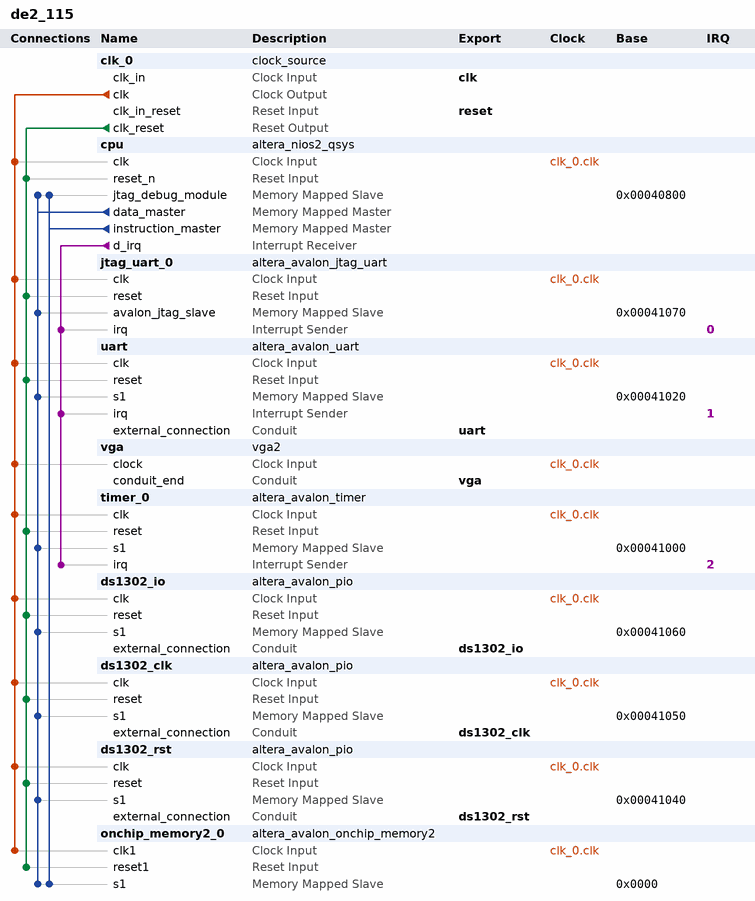
[diagram p0: system contents]
# Platform Designer (Qsys) system de2_115, Cyclone IV E EP4CE115F29C7
# Parameters at their usual value, and those the tool derives, are not listed.
package require -exact qsys 13.0.1.99.2
create_system de2_115
set_project_property DEVICE_FAMILY {Cyclone IV E}
set_project_property DEVICE EP4CE115F29C7

add_instance clk_0 clock_source 13.0
set_instance_parameter_value clk_0 clockFrequency 50000000

add_instance cpu altera_nios2_qsys 13.0
set_instance_parameter_value cpu resetSlave onchip_memory2_0.s1
set_instance_parameter_value cpu mmu_TLBMissExcSlave None
set_instance_parameter_value cpu exceptionSlave onchip_memory2_0.s1
set_instance_parameter_value cpu breakSlave cpu.jtag_debug_module
set_instance_parameter_value cpu muldiv_multiplierType NoneSmall
set_instance_parameter_value cpu impl Tiny
set_instance_parameter_value cpu icache_size 4096

add_instance jtag_uart_0 altera_avalon_jtag_uart 13.0.1.99.2
set_instance_parameter_value jtag_uart_0 simInteractiveOptions NO_INTERACTIVE_WINDOWS

add_instance uart altera_avalon_uart 13.0.1.99.2
set_instance_parameter_value uart baud 115200
set_instance_parameter_value uart dataBits 8
set_instance_parameter_value uart fixedBaud true
set_instance_parameter_value uart parity NONE
set_instance_parameter_value uart stopBits 1

add_instance vga vga2 1.0
set_instance_parameter_value vga CLOCK_OUTPUT 1
set_instance_parameter_value vga BITS_PER_COLOR 1

add_instance timer_0 altera_avalon_timer 13.0.1.99.2
set_instance_parameter_value timer_0 period 1
set_instance_parameter_value timer_0 periodUnits SEC

add_instance ds1302_io altera_avalon_pio 13.0.1.99.2
set_instance_parameter_value ds1302_io direction Bidir
set_instance_parameter_value ds1302_io width 1

add_instance ds1302_clk altera_avalon_pio 13.0.1.99.2
set_instance_parameter_value ds1302_clk direction Output
set_instance_parameter_value ds1302_clk width 1

add_instance ds1302_rst altera_avalon_pio 13.0.1.99.2
set_instance_parameter_value ds1302_rst direction Output
set_instance_parameter_value ds1302_rst width 1

add_instance onchip_memory2_0 altera_avalon_onchip_memory2 13.0.1.99.2
set_instance_parameter_value onchip_memory2_0 dataWidth 32
set_instance_parameter_value onchip_memory2_0 dualPort false
set_instance_parameter_value onchip_memory2_0 initMemContent true
set_instance_parameter_value onchip_memory2_0 initializationFileName onchip_mem.hex
set_instance_parameter_value onchip_memory2_0 memorySize 65536

# connections
add_connection clk_0.clk cpu.clk clock
add_connection clk_0.clk ds1302_clk.clk clock
add_connection clk_0.clk ds1302_io.clk clock
add_connection clk_0.clk ds1302_rst.clk clock
add_connection clk_0.clk jtag_uart_0.clk clock
add_connection clk_0.clk onchip_memory2_0.clk1 clock
add_connection clk_0.clk timer_0.clk clock
add_connection clk_0.clk uart.clk clock
add_connection clk_0.clk vga.clock clock
add_connection clk_0.clk_reset cpu.reset_n reset
add_connection clk_0.clk_reset ds1302_clk.reset reset
add_connection clk_0.clk_reset ds1302_io.reset reset
add_connection clk_0.clk_reset ds1302_rst.reset reset
add_connection clk_0.clk_reset jtag_uart_0.reset reset
add_connection clk_0.clk_reset onchip_memory2_0.reset1 reset
add_connection clk_0.clk_reset timer_0.reset reset
add_connection clk_0.clk_reset uart.reset reset
add_connection cpu.data_master cpu.jtag_debug_module avalon
set_connection_parameter_value cpu.data_master/cpu.jtag_debug_module baseAddress 0x00040800
add_connection cpu.data_master ds1302_clk.s1 avalon
set_connection_parameter_value cpu.data_master/ds1302_clk.s1 baseAddress 0x00041050
add_connection cpu.data_master ds1302_io.s1 avalon
set_connection_parameter_value cpu.data_master/ds1302_io.s1 baseAddress 0x00041060
add_connection cpu.data_master ds1302_rst.s1 avalon
set_connection_parameter_value cpu.data_master/ds1302_rst.s1 baseAddress 0x00041040
add_connection cpu.data_master jtag_uart_0.avalon_jtag_slave avalon
set_connection_parameter_value cpu.data_master/jtag_uart_0.avalon_jtag_slave baseAddress 0x00041070
add_connection cpu.data_master onchip_memory2_0.s1 avalon
set_connection_parameter_value cpu.data_master/onchip_memory2_0.s1 baseAddress 0x0000
add_connection cpu.data_master timer_0.s1 avalon
set_connection_parameter_value cpu.data_master/timer_0.s1 baseAddress 0x00041000
add_connection cpu.data_master uart.s1 avalon
set_connection_parameter_value cpu.data_master/uart.s1 baseAddress 0x00041020
add_connection cpu.instruction_master cpu.jtag_debug_module avalon
set_connection_parameter_value cpu.instruction_master/cpu.jtag_debug_module baseAddress 0x00040800
add_connection cpu.instruction_master onchip_memory2_0.s1 avalon
set_connection_parameter_value cpu.instruction_master/onchip_memory2_0.s1 baseAddress 0x0000
add_connection cpu.d_irq jtag_uart_0.irq interrupt
set_connection_parameter_value cpu.d_irq/jtag_uart_0.irq irqNumber 0
add_connection cpu.d_irq timer_0.irq interrupt
set_connection_parameter_value cpu.d_irq/timer_0.irq irqNumber 2
add_connection cpu.d_irq uart.irq interrupt
set_connection_parameter_value cpu.d_irq/uart.irq irqNumber 1

# exported interfaces
add_interface clk clock sink
set_interface_property clk EXPORT_OF clk_0.clk_in
add_interface reset reset sink
set_interface_property reset EXPORT_OF clk_0.clk_in_reset
add_interface uart conduit end
set_interface_property uart EXPORT_OF uart.external_connection
add_interface vga conduit end
set_interface_property vga EXPORT_OF vga.conduit_end
add_interface ds1302_io conduit end
set_interface_property ds1302_io EXPORT_OF ds1302_io.external_connection
add_interface ds1302_rst conduit end
set_interface_property ds1302_rst EXPORT_OF ds1302_rst.external_connection
add_interface ds1302_clk conduit end
set_interface_property ds1302_clk EXPORT_OF ds1302_clk.external_connection

set_interconnect_requirement {$system} qsys_mm.clockCrossingAdapter HANDSHAKE
set_interconnect_requirement {$system} qsys_mm.maxAdditionalLatency 1

save_system de2_115.qsys
